# Altium schematic sheet ESP_OBD_Handheld.SchDoc
size A4; SheetNumber: 1; SheetTotal: 1; SPICEModelCacheXHSDZURL: <root> / <DocumentId>XHSDZURL</DocumentId> / </root>
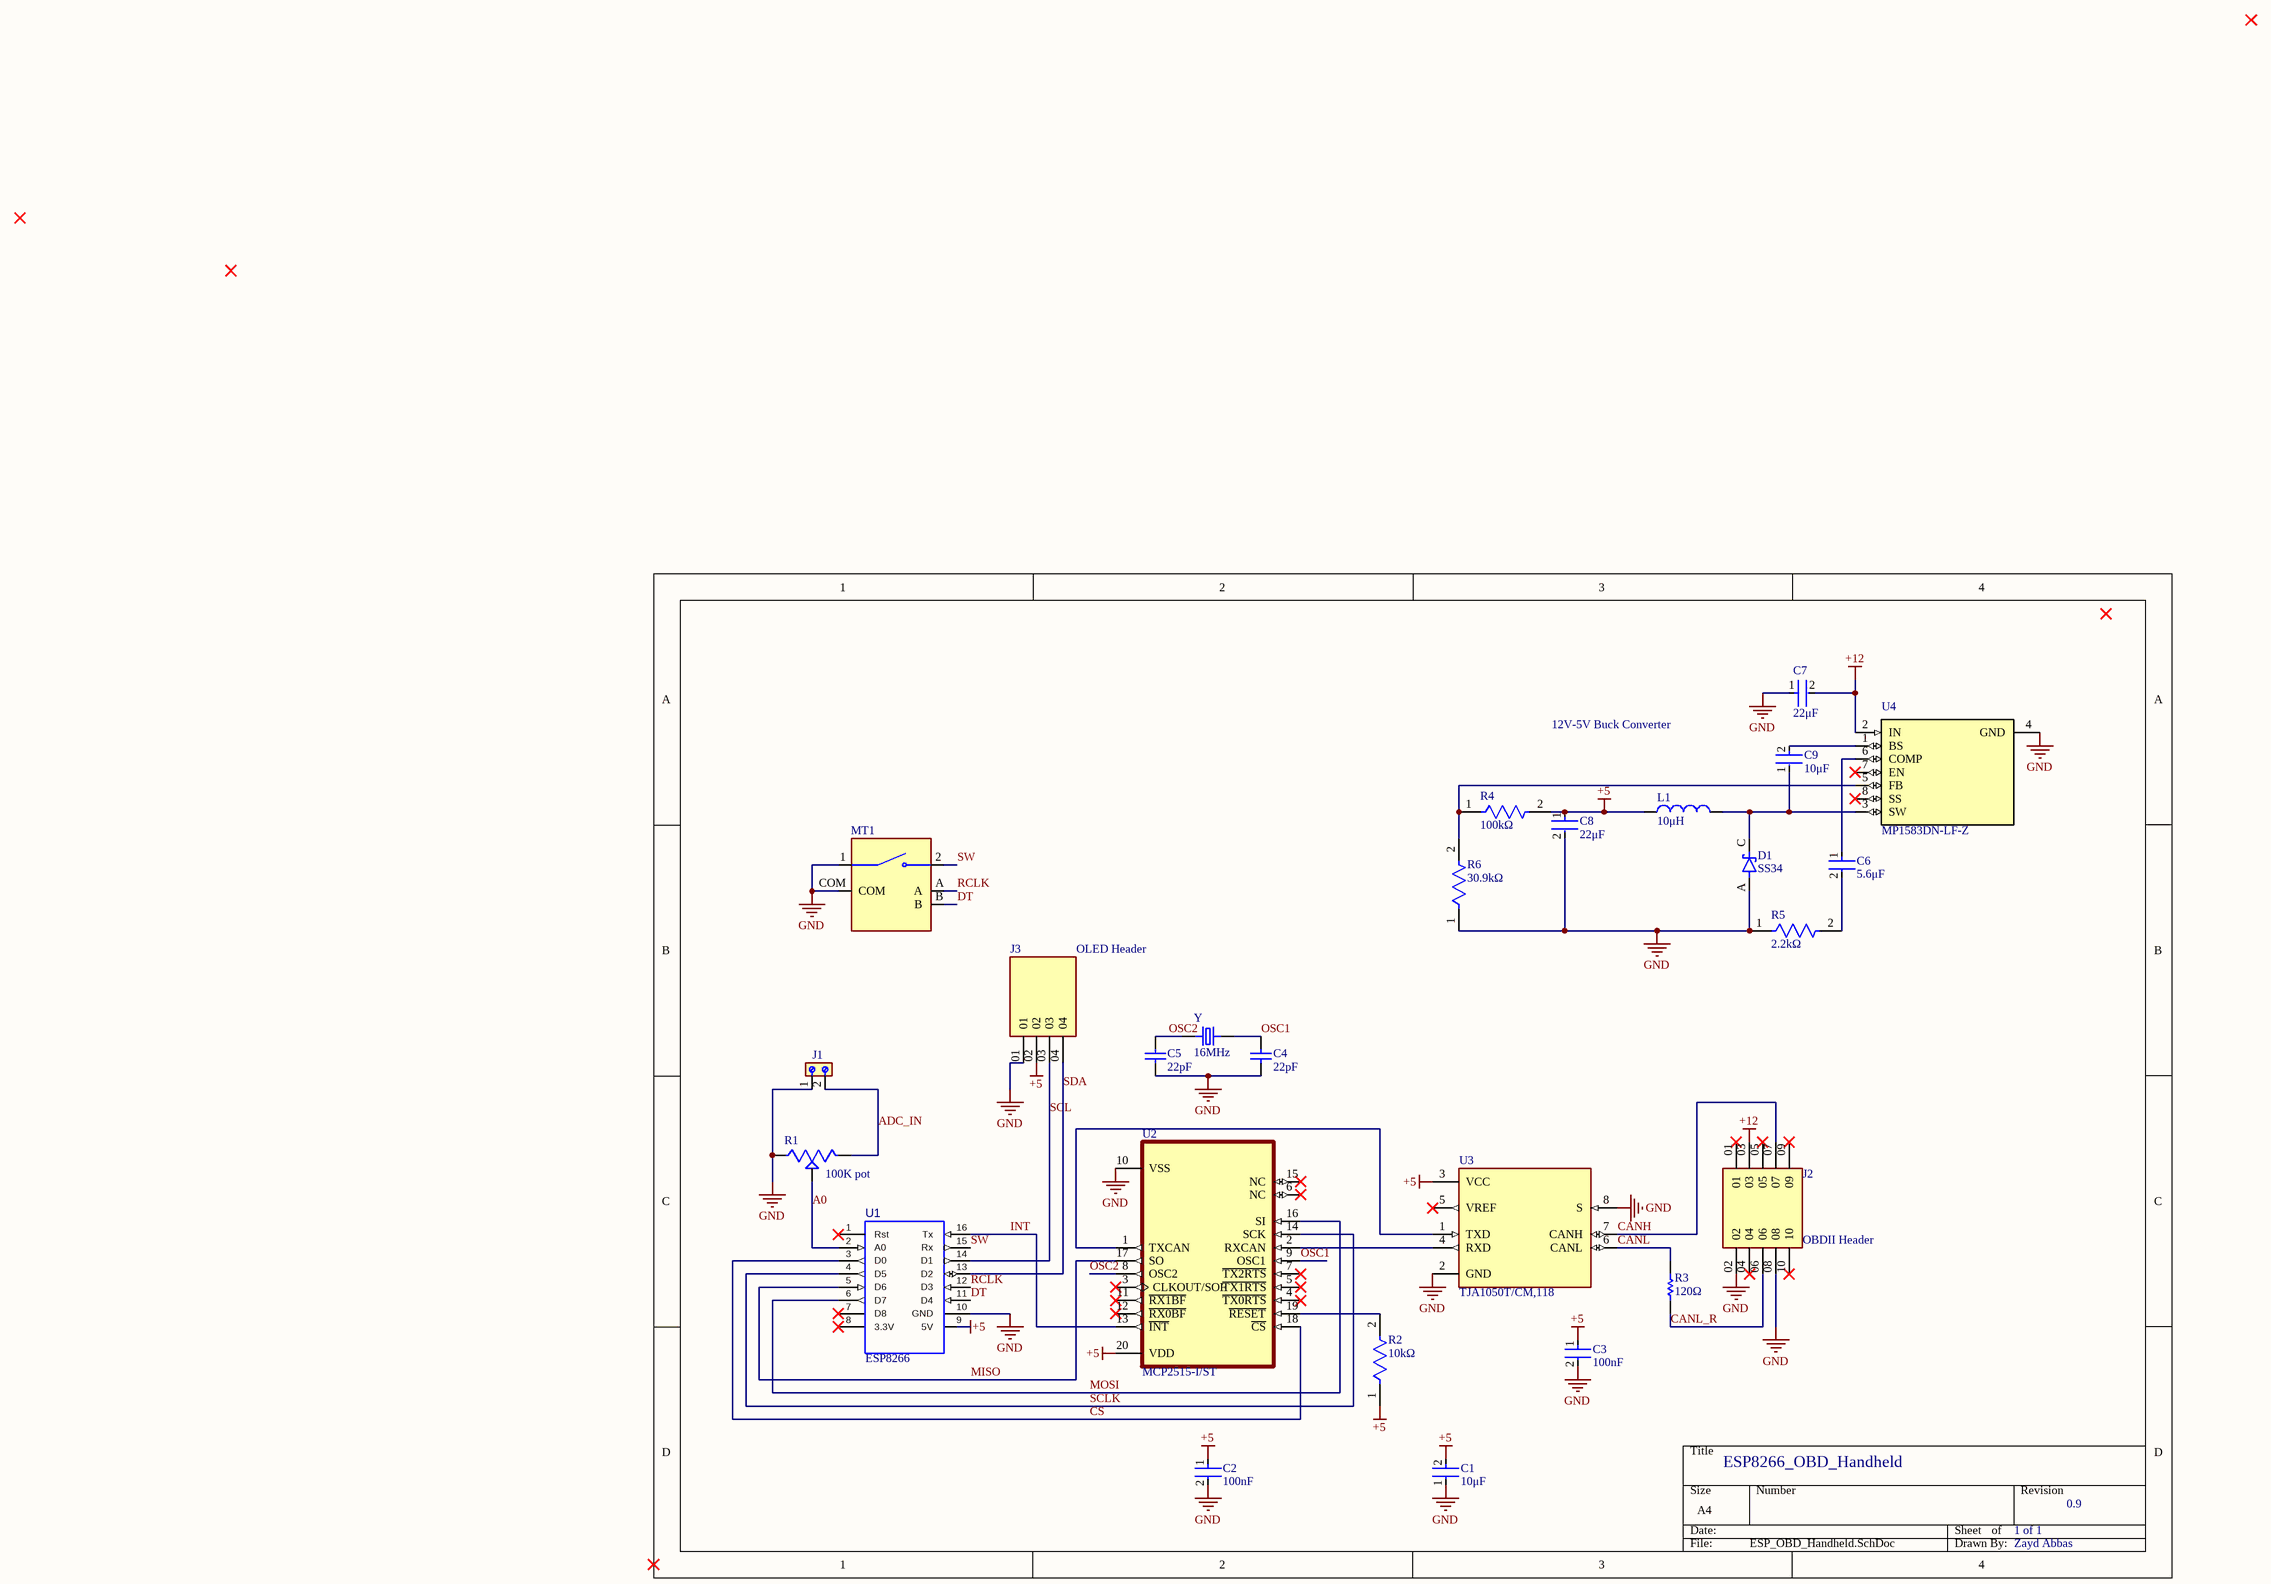
[diagram p0: ESP_OBD_Handheld.SchDoc]

## Parts
C1  10μF  [FP-C1608-080-0_1-MFG]
C2  100nF  [FP-CGA3E-0_3-0_1-IPC_C]
C3  100nF  [FP-CGA3E-0_3-0_1-IPC_C]
C4  22pF  [CAPC1608X90X35LL10T15]
C5  22pF  [CAPC1608X90X35LL10T15]
C6  5.6μF  [FP-CC0603-DA-IPC_B]
C7  22μF  [FP-C2012-125-0_2-MFG]
C8  22μF  [FP-C2012-125-0_2-MFG]
C9  10μF  [FP-C1608-080-0_1-MFG]
D1  SS34  [DIOM7959X265N]
J1  691102710002  [691102710002]  (value not drawn)
J2  TSW-105-05-G-D  [SAMTEC_TSW-105-05-G-D]  (value not drawn)
J3  TLW-104-05-G-S  [SAMTEC_TLW-104-05-G-S]  (value not drawn)
L1  10μH  [VISH-IHLP2525C-01_V]
MT1  PEC11R-4215F-S0024  [XDCR_PEC11R-4215F-S0024]  (value not drawn)
R1  100K pot  [TRIM_3296P-1-104LF]
R2  10kΩ  [FP-RC0603-0_55-IPC_B]
R3  120Ω  [RESC1609X55X30LL15T15]
R4  100kΩ  [FP-RC0603-0_55-MFG]
R5  2.2kΩ  [FP-AC0603-IPC_C]
R6  30.9kΩ  [FP-RT0603-IPC_C]
U1  ESP8266  [wemos-d1-mini-with-pin-header-and-connector]
U2  MCP2515-I/ST  [SOP65P640X110-20N]
U3  TJA1050T/CM,118  [SOIC127P600X175-8N]
U4  MP1583DN-LF-Z  [*SOIC127P600X170-9N]
Y  16MHz  [XTAL_ECS-160-20-4X]

## Nets
+5: C1.2 C2.1 C3.1 C8.1 J3.02 L1.1 R2.1 R4.2 U1.9(5V) U2.20(VDD) U3.3(VCC)
+12: C7.2 J2.03 U4.2(IN)
GND: C1.1 C2.2 C3.2 C4.1 C5.1 C7.1 C8.2 D1.A J1.1 J2.02 J2.08 J3.01 MT1.1 MT1.COM R1.1(CCW) R5.1 R6.1 U1.10(GND) U2.10(VSS) U3.2(GND) U3.8(S) U4.4(GND)
A0: R1.2(WIPER) U1.2(A0)
ADC_IN: J1.2 R1.3(CW)
CANH: J2.07 U3.7(CANH)
CANL: R3.1 U3.6(CANL)
CANL_R: J2.06 R3.2
CS: U1.3(D0) U2.18(~{CS})
DT: MT1.B U1.11(D4)
INT: U1.16(Tx) U2.13(~{INT})
MISO: U1.5(D6) U2.17(SO)
MOSI: U1.6(D7) U2.16(SI)
OSC1: C4.2 U2.9(OSC1) Y.2
OSC2: C5.2 U2.8(OSC2) Y.1
RCLK: MT1.A U1.12(D3)
SCL: J3.03 U1.14(D1)
SCLK: U1.4(D5) U2.14(SCK)
SDA: J3.04 U1.13(D2)
SW: MT1.2 U1.15(Rx)
NetC6_1: C6.1 U4.6(COMP)
NetC6_2: C6.2 R5.2
NetC9_1: C9.1 D1.C(K) L1.2 U4.3(SW)
NetC9_2: C9.2 U4.1(BS)
NetR2_2: R2.2 U2.19(~{RESET})
NetR4_1: R4.1 R6.2 U4.5(FB)
NetU2_1: U2.1(TXCAN) U3.1(TXD)
NetU2_2: U2.2(RXCAN) U3.4(RXD)

Not connected (* = marked no-connect by the designer): J2 01* 04* 05* 09* 10*; U1 1(Rst)* 7(D8)* 8(3.3V)*; U2 3(CLKOUT/SOF)* 4(~{TX0RTS})* 5(~{TX1RTS})* 6(NC)* 7(~{TX2RTS})* 11(~{RX1BF})* 12(~{RX0BF})* 15(NC)*; U3 5(VREF)*; U4 7(EN)* 8(SS)*

## Notes on the sheet
- 12V-5V Buck Converter
- OLED Header
- (near J2) OBDII Header
- ESP8266_OBD_Handheld
- 1 of 1
- 0.9
- Zayd Abbas

## Library data of the parts
C1 C9 = CMP-2000-04979-3: Multilayer Ceramic Capacitors 10μF ±10% 10V X5R SMD 0603; Capacitance: 10uF; Dielectric Material: Ceramic; Construction: Flat; Height: 0.8mm; Thickness: 0.035inch; Case Code (Metric): 1608; Radiation Hardening: No; Number of Pins: 2; Voltage Rating (DC): 10V; Depth: 0.8mm; Voltage: 10V; RoHS Compliant: Yes; Voltage Rating: 10V; Package Quantity: 1; Resistor Type: Ceramic; Termination: SMD/SMT; Lead Free: Lead Free; REACH SVHC: No SVHC; Tolerance: 10%; Mount: Surface Mount; Series: C; Packaging: Tape and Reel; Width: 0.8mm; Dielectric: X5R; Weight: 7.1E-05oz; Length: 1.6mm; Max Operating Temperature: 85°C; Case Code (Imperial): 0603; Case/Package: 0603; Min Operating Temperature: -55°C
C2 C3 = CMP-2000-07546-2: Cap Ceramic 100nF 50V X7R 10% Pad SMD 0603 +125°C Automotive T/R; Weight: 7.1E-05oz; Composition: Ceramic; Max Operating Temperature: 125°C; Termination: SMD/SMT; Dielectric: X7R; Length: 1.6mm; Package Quantity: 1; REACH SVHC: No SVHC; Lead Free: Lead Free; Case Code (Metric): 1608; Min Operating Temperature: -55°C; Packaging: Tape and Reel; Tolerance: 10%; Voltage Rating: 50V; Case Code (Imperial): 0603; Capacitance: 100nF; Case/Package: 0603; Voltage Rating (DC): 50V; Depth: 0.8mm; Radiation Hardening: No; Ratings: AEC-Q200; Mount: Surface Mount; Voltage: 50V; Thickness: 0.035inch; Width: 0.8mm; Height: 0.8mm
C4 C5 = CMP-2000-04945-1: Chip Capacitor, 22 pF, +/- 5%, 50 V, -55 to 125 degC, 0603 (1608 Metric), RoHS, Tape and Reel; Manufacturer: Murata; Rated Voltage: 50V; Dielectric: C0G; Capacitance: 22pF; Manufacturer URL: http://www.murata.com/; Datasheet Version: Jul-06; Package Reference: 603; Tolerance (%): ±5%; Case Size/Dimension: 0603; Package Description: 2-Pin Surface Mount Device, Body 1.6 x 0.8 mm; Datasheet URL: https://datasheet.ciiva.com/11786/0900766b807a1cab-11786398.pdf
C6 = CMP-03422-001341-1: Surface Mount Ceramic Multilayer Capacitor 0.0056uF 10% X7R 50V 0603 Paper T/R; Manufacturer Part Number: CC0603KRX7R9BB562; Manufacturer: YAGEO; Tolerance: 0.1; Capacitance: 5.6 nF; Temperature Coefficient: 15%; Value: 5.6 nF; Automotive: No; Category: Cap; RoHS: TRUE; Lead Free: Yes; Temperature Range Low: -55°C; Height: 0.9mm; Material: Ceramic; Device Class L3: Ceramic Capacitors; Digikey Description: Surface Mount Ceramic Multilayer Capacitor 0.0056uF 10% X7R 50V 0603 Paper T/R; Device Class L2: Capacitors; Voltage: 50 V; Temperature: -55°C to +125°C; Octopart: https://octopart.com/cc0603krx7r9bb562-yageo-42336084; Package: CC0603-DA; ComponentLink2URL: http://www.yageo.com/documents/recent/UPY-GPHC_X7R_6.3V-to-50V_18.pdf; Device Class L1: Passive Components; Mouser Description: Multilayer Ceramic Capacitors MLCC - SMD/SMT 5.6nF 50V X7R 10%; Temperature Characteristic: X7R; Temperature Range High: +125°C; Voltage Rating: 50 V; ComponentLink2Description: Datasheet; Footprint Url: http://www.yageo.com/exep/pages/download/literatures/UPY-C_GEN_24.pdf
C7 C8 = CMP-2000-06037-3: Multilayer Ceramic Capacitors 22μF ±10% 16V X5R SMD 0805; Capacitance: 22uF; Thickness: 0.057inch; Series: C; Weight: 0.000194oz; Construction: Flat; Max Operating Temperature: 85°C; Case Code (Imperial): 0805; Width: 0.049inch; Depth: 1.25mm; Dielectric: X5R; Case/Package: 0805; Voltage Rating: 16V; Mount: Surface Mount; Dielectric Material: Ceramic; Packaging: Tape and Reel; Resistor Type: Ceramic; Number of Pins: 2; Lead Free: Lead Free; REACH SVHC: No SVHC; Tolerance: 10%; Termination: Wraparound; Min Operating Temperature: -55°C; Case Code (Metric): 2012; RoHS Compliant: Yes; Voltage: 16V; Length: 2mm; Voltage Rating (DC): 16V; Package Quantity: 1; Height: 1.25mm
D1 = SS34: Diode Schottky 40 V 3A Surface Mount SMC (DO-214AB); MF: ON Semiconductor; Price: None; Availability: In Stock; MP: SS34; Package: SMC-2 ON Semiconductor; SnapEDA_Link: https://www.snapeda.com/parts/SS34/Onsemi/view-part/?ref=snap; Check_prices: https://www.snapeda.com/parts/SS34/Onsemi/view-part/?ref=eda; Value: *; Purchase-URL: https://pricing.snapeda.com/search/part/SS34/?ref=eda
J1 = 691102710002: 2 Position Wire to Board Terminal Block Horizontal with Board 0.197 (5.00mm) Through Hole; MF: Wurth Elektronik; MP: 691102710002; SnapEDA_Link: https://www.snapeda.com/parts/691102710002/Wurth+Elektronik/view-part/?ref=snap; Purchase-URL: https://pricing.snapeda.com/search/part/691102710002/?ref=eda; Value: *; Package: None; Price: None; Availability: In Stock; Check_prices: https://www.snapeda.com/parts/691102710002/Wurth+Elektronik/view-part/?ref=eda
J2 = TSW-105-05-G-D: MF: Samtec; Package: None; Value: *; Availability: Unavailable; MP: TSW-105-05-G-D; Price: None
L1 = CMP-2000-06440-1: Low-Profile, High Current IHLP(R) Inductor, 10 uH, 5 MHz, -55 to 125 degC, 2-Pin SMD, RoHS, Tape and Reel; Manufacturer: Vishay; Maximum DC Resistance: 105mOhms; Brand: Vishay/Dale; Type: LowProfileHighCurrentIHLPInductors; Case Width: 6.47mm; Test Frequency: 100kHz; Shielding: Shielded; Self Resonant Frequency: 5MHz; Tolerance: 20%; Case Length: 6.86mm; Case Height: 3mm; Maximum DC Current: 3A; Inductance: 10uH; Mounting Technology: SurfaceMount; Product: PowerInductors; Operating Temperature Range: -55Cto+125C; Series: IHLP-2525CZ-01; Package / Case: 2525(6363metric); Termination Style: SMD/SMT; Package Reference: IHLP2525C-01; RoHS: Details; Datasheet Version: 02/2015; Package Description: 2-Pin Surface Mount Device; Manufacturer URL: http://www.vishay.com/; Product Category: FixedInductors; Packaging: Reel; Datasheet URL: http://download.siliconexpert.com/pdfs/2016/3/15/16/5/35/891/vsh_/manual/812046841784326lp25cz01.pdf
MT1 = PEC11R-4215F-S0024: Incremental Encoder, 12 Mm, Contact Rating 10 Ma - 5 Vdc; Price: None; Availability: Unavailable; MP: PEC11R-4215F-S0024; Value: *; Package: None
R1 = 3296P-1-104LF: 100 kOhms 0.5W, 1/2W PC Pins Through Hole Trimmer Potentiometer Cermet 25.0 Turn Side Adjustment; MF: Bourns; Availability: In Stock; SnapEDA_Link: https://www.snapeda.com/parts/3296P-1-104LF/Bourns/view-part/?ref=snap; Price: None; Check_prices: https://www.snapeda.com/parts/3296P-1-104LF/Bourns/view-part/?ref=eda; Purchase-URL: https://pricing.snapeda.com/search/part/3296P-1-104LF/?ref=eda; Package: NON-STANDARD-3 Bourns; MP: 3296P-1-104LF; Value: *
R2 = CMP-2100-03664-2: RES 10K OHM 1% 1/10W 0603; Voltage Rating: 75V; Voltage Rating (DC): 50V; Resistance: 10kR; Power Rating: 100mW; Temperature Coefficient: 100ppm/°C; Depth: 0.8mm; Termination: SMD/SMT; Resistor Type: Thick Film; Series: RC; Construction: Rectangular; Features: Moisture Resistant; Packaging: Tape and Reel; Min Operating Temperature: -55°C; Number of Terminations: 2; Lead Pitch: 0.3mm; RoHS Compliant: Yes; Case/Package: 0603; Resistance Tolerance: 1%; Military Standard: Not; Weight: 7.1E-05oz; Number of Pins: 2; Tolerance: 1%; Length: 1.6mm; Case Code (Imperial): 0603; Lead Free: Lead Free; Width: 0.8mm; Max Power Dissipation: 100mW; Height: 0.45mm; Max Operating Temperature: 155°C; Case Code (Metric): 1608; Size Code: 0603
R3 = CMP-2000-00213-2: Chip Resistor, 120 Ohm, +/- 1%, 0.1 W, -55 to 155 degC, 0603 (1608 Metric), RoHS, Tape and Reel; Manufacturer: Panasonic; Power Rating: 100mW; Voltage Rating (DC): 75V; Resistance: 120Ohm; Temperature Coefficient: 100ppm/degreesC; Number of Terminations: 2; Military Standard: Not; Tolerance: 1%; Min Operating Temperature: -55degC; Packaging: TapeandReel; Lead Free: LeadFree; Max Operating Temperature: 155degC; Manufacturer URL: http://www.panasonic.com/; Case Code (Imperial): 0603; REACH SVHC: NoSVHC; Width: 0.031inch; Datasheet URL: https://industrial.panasonic.com/cdbs/www-data/pdf/RDA0000/AOA0000C283.pdf; RoHSCompliant: true; Max Power Dissipation: 100mW; Termination: SMD/SMT; Package Reference: 0603; Height: 0.022inch; Depth: 0.8mm; Package Description: 2-Pin Surface Mount Device, Body 1.6 x 0.85 mm; Contact Plating: Tin; Length: 1.6mm; Package URL: http://www.st.com/st-web-ui/static/active/en/resource/technical/document/datasheet/CD00001320.pdf; Radiation Hardening: No; Package Quantity: 1; Number of Pins: 2; Datasheet Version: 42095.0; Voltage Rating: 75V; Composition: ThickFilm; Case/Package: 0603; Mount: SurfaceMount; Case Code (Metric): 1608
R4 = CMP-2100-03662-2: RES SMD 100K OHM 1% 1/10W 0603; Voltage Rating (DC): 50V; Resistance: 100kR; Max Power Dissipation: 100mW; Temperature Coefficient: 100ppm/°C; Working Voltage: 75V; Length: 1.6mm; Lead Free: Lead Free; Number of Terminations: 2; Packaging: Tape and Reel; Voltage Rating: 50V; Termination: SMD/SMT; Width: 0.8mm; Resistor Type: Thick Film; Resistance Tolerance: 1%; Features: Moisture Resistant; Height: 0.45mm; Construction: Rectangular; Case/Package: 0603; Military Standard: Not; Case Code (Imperial): 0603; Series: RC; Technology: THICK FILM; Depth: 0.8mm; RoHS Compliant: Yes; REACH SVHC: No SVHC; Min Operating Temperature: -55°C; Case Code (Metric): 1608; Max Operating Temperature: 155°C; Power Rating: 100mW; Number of Pins: 2; Tolerance: 1%
R5 = CMP-2000-04835-3: RES 2.2KΩ 1.00% 0.1W 0603; Tolerance: 1%; Max Power Dissipation: 100mW; Temperature Coefficient: 100ppm/°C; Voltage Rating: 50V; Resistance: 2.2kR; Features: Moisture Resistant; Size Code: 0603; Termination: SMD/SMT; Packaging: Tape and Reel; Min Operating Temperature: -55°C; Case/Package: 0603; Width: 0.031inch; Case Code (Metric): 1608; Package Quantity: 1; Height: 0.022inch; Number of Terminations: 2; Depth: 0.8mm; Construction: Rectangular; Power Rating: 100mW; Ratings: AEC-Q200; Series: AC; Case Code (Imperial): 0603; RoHS Compliant: Yes; Resistor Type: Thick Film; Military Standard: Not; Length: 0.063inch; Max Operating Temperature: 155°C; Lead Free: Lead Free
R6 = CMP-03412-016275-1: RES SMD 30.9K OHM 0.1% 1/10W; Manufacturer: Yageo; Manufacturer Part Number: RT0603BRD0730K9L; Temperature Coefficient: 25 ppm/°C; Power Rating: 0.1W; Tolerance: 0.001; Voltage Rating: 75V; Footprint Url: http://www.yageo.com/exep/pages/download/literatures/PYu-R_Mount_10.pdf; Package: RT0603; Temperature Range Low: -55°C; Category: Res; RoHS: TRUE; Composition: Thin Film; Device Class L1: Passive Components; Value: 30.9KΩ; Octopart: https://octopart.com/rt0603brd0730k9l-yageo-1244231; ComponentLink2URL: http://www.yageo.com/documents/recent/PYu-RT_1-to-0.01_RoHS_L_9.pdf; Ipc Land Pattern Name: RESC16080X45; Device Class L2: Resistors; ComponentLink2Description: Datasheet; Temperature Range High: +155°C; Lead Free: Yes; Height: 0.55mm; Resistance: 30.9KΩ; Series: RT; Automotive: No; Temperature: -55°C to +155°C; Digikey Description: RES SMD 30.9K OHM 0.1% 1/10W; Device Class L3: Chip SMD Resistors; Mouser Description: Res Thin Film 0603 30.9K Ohm 0.1% 1/10W ±25ppm/°C Molded SMD Paper T/R
U1 = WeMos_D1_mini: ki_keywords: esp8266, wemos; ki_description: WeMos D1 mini; Value: WeMos_D1_mini; Supplier: http://www.wemos.cc/Products/d1_mini.html
U2 = MCP2515-I/ST: CANbus Controller CAN 2.0 SPI Interface 20-TSSOP; MF: Microchip; Price: None; Package: TSSOP-20 Microchip; Availability: Unavailable; SnapEDA_Link: https://www.snapeda.com/parts/MCP2515-I/ST/Microchip/view-part/39880/?ref=snap; Value: *; MP: MCP2515-I/ST
U3 = TJA1050T/CM,118: 1/1 Transceiver Half CANbus 8-SO; MF: NXP USA; SnapEDA_Link: https://www.snapeda.com/parts/TJA1050T/CM,118/NXP%20USA%20Inc./view-part/304529/?ref=snap; Value: *; Purchase-URL: https://pricing.snapeda.com/search/part/TJA1050T/CM,118/?ref=eda; Check_prices: https://www.snapeda.com/parts/TJA1050T/CM,118/NXP%20USA%20Inc./view-part/304529/?ref=eda; Price: None; Availability: In Stock; MP: TJA1050T/CM,118; Package: SO-8 NXP Semiconductors
Y = ECS-160-S-4: 16MHz Â±30ppm Crystal Series 40 Ohms HC-49/US; MF: ECS Inc.; SnapEDA_Link: https://www.snapeda.com/parts/ECS-160-S-4/ECS%20Inc./view-part/3657575/?ref=snap; Value: *; Availability: Unavailable; Price: None; MP: ECS-160-S-4; Package: HC49/US ECS International
J3 = TLW-104-05-G-S: Price: None; Value: *; Package: None; MP: TLW-104-05-G-S; Availability: Unavailable
U4 = MP1583DN-LF-Z: Check_prices: https://www.snapeda.com/parts/MP1583DN-LF-Z/Monolithic+Power+Systems+Inc./view-part/?ref=eda; SnapEDA_Link: https://www.snapeda.com/parts/MP1583DN-LF-Z/Monolithic+Power+Systems+Inc./view-part/?ref=snap; Value: *